# EAGLE design stmotor (EAGLE 7.2.0)
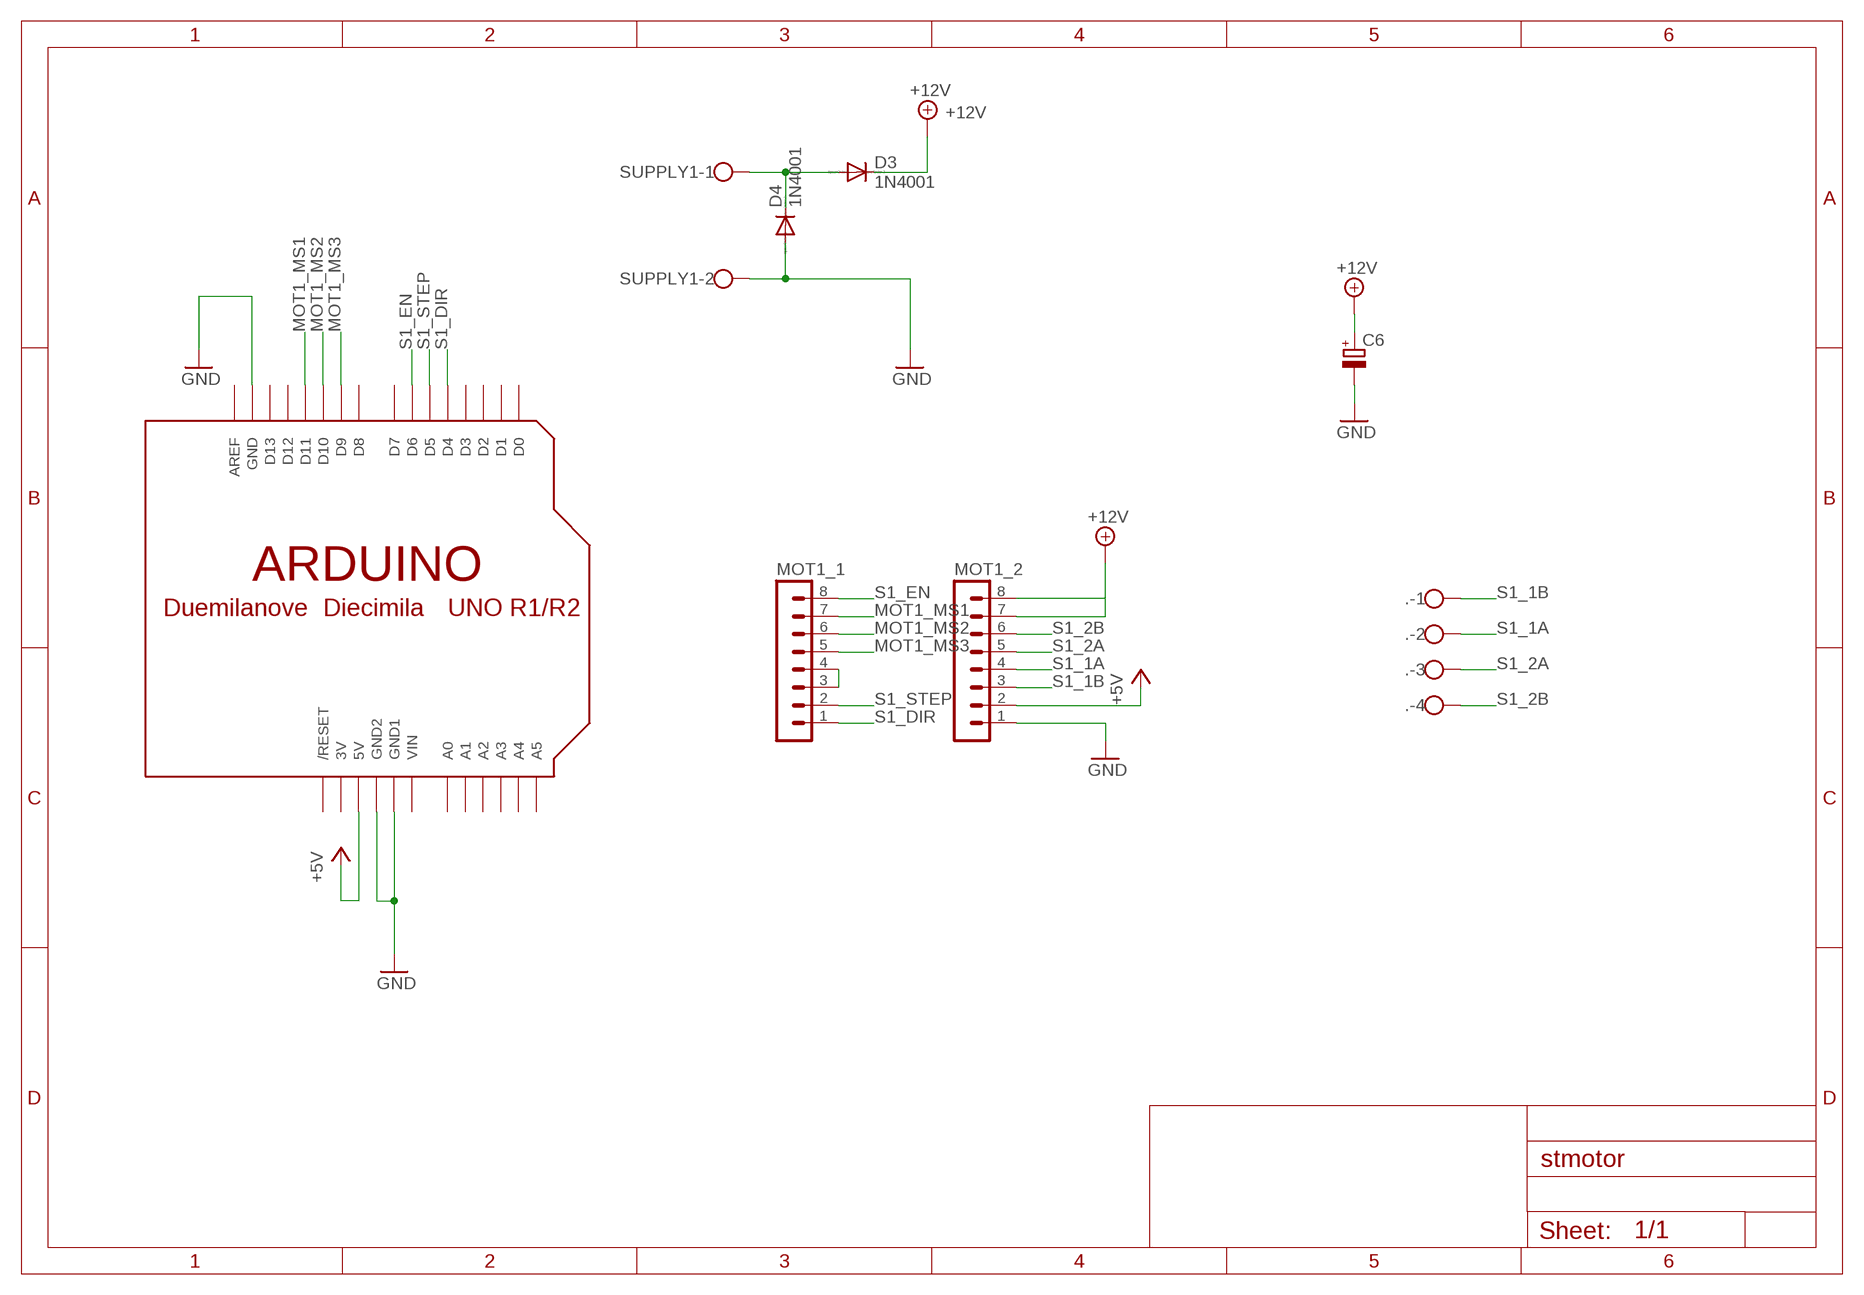
[diagram p0: schematic, sheet 1]

## Parts
.  W237-4  [W237-4]
C6  CPOL-EU153CLV-0807  [153CLV-0807]
D3  1N4001  1N4004  [DO41-10]
D4  1N4001  1N4004  [DO41-10]
MOT1_1  MA08-1  [MA08-1]
MOT1_2  MA08-1  [MA08-1]
SUPPLY1  W237-102  [W237-102]
U$1  ARDUINO-NOHOLE  [ARDUINO-NOHOLE]

## Nets
+5V: MOT1_2.2 U$1.5V
+12V: C6.+ D3.C MOT1_2.7
GND: C6.- D4.A MOT1_2.1 SUPPLY1.2 U$1.GND U$1.GND1 U$1.GND2
MOT1_MS1: MOT1_1.7 U$1.D11
MOT1_MS2: MOT1_1.6 U$1.D10
MOT1_MS3: MOT1_1.5 U$1.D9
N$1: D3.A D4.C SUPPLY1.1
N$2: MOT1_2.8
S1_1A: ..2 MOT1_2.4
S1_1B: ..1 MOT1_2.3
S1_2A: ..3 MOT1_2.5
S1_2B: ..4 MOT1_2.6
S1_DIR: MOT1_1.1 U$1.D4
S1_EN: MOT1_1.8 U$1.D6
S1_RST: MOT1_1.3 MOT1_1.4
S1_STEP: MOT1_1.2 U$1.D5
Unconnected: U$1.A0 U$1.A1 U$1.A2 U$1.A3 U$1.A4 U$1.A5 U$1.AREF U$1.D0 U$1.D1 U$1.D2 U$1.D3 U$1.D7 U$1.D8 U$1.D12 U$1.D13 U$1.RESET(/RESET)

## Power pins joined to a net without a drawn wire
3V: U$1.3V
VIN: U$1.VIN

## Library data of the parts
. = con-wago-500:W237-4: WAGO SCREW CLAMP; OC_FARNELL: unknown; OC_NEWARK: unknown
C6 = rcl:CPOL-EU: POLARIZED CAPACITOR, European symbol
D3 D4 = diode:1N4004: DIODE general purpose rectifier, 1 A
MOT1_1 MOT1_2 = con-lstb:MA08-1: PIN HEADER; OC_FARNELL: unknown; OC_NEWARK: unknown
SUPPLY1 = con-wago-500:W237-102: WAGO SCREW CLAMP; MPN: 237-102; OC_FARNELL: unknown; OC_NEWARK: 70K9898
U$1 = adafruit:ARDUINO: Arduino Diecimila/Duemilanove Make a shield with ease, this package has all the named pins as well as the two mounting drill holes and an outline of the USB and DC power connector. The outline is on the DIMENSION layer, so if your board house uses it they will cut the outline to match. http://www.ladyada.net/library/pcb/eaglelibrary.html

## Net classes
1 +12V: width 1.016 mm

## Board
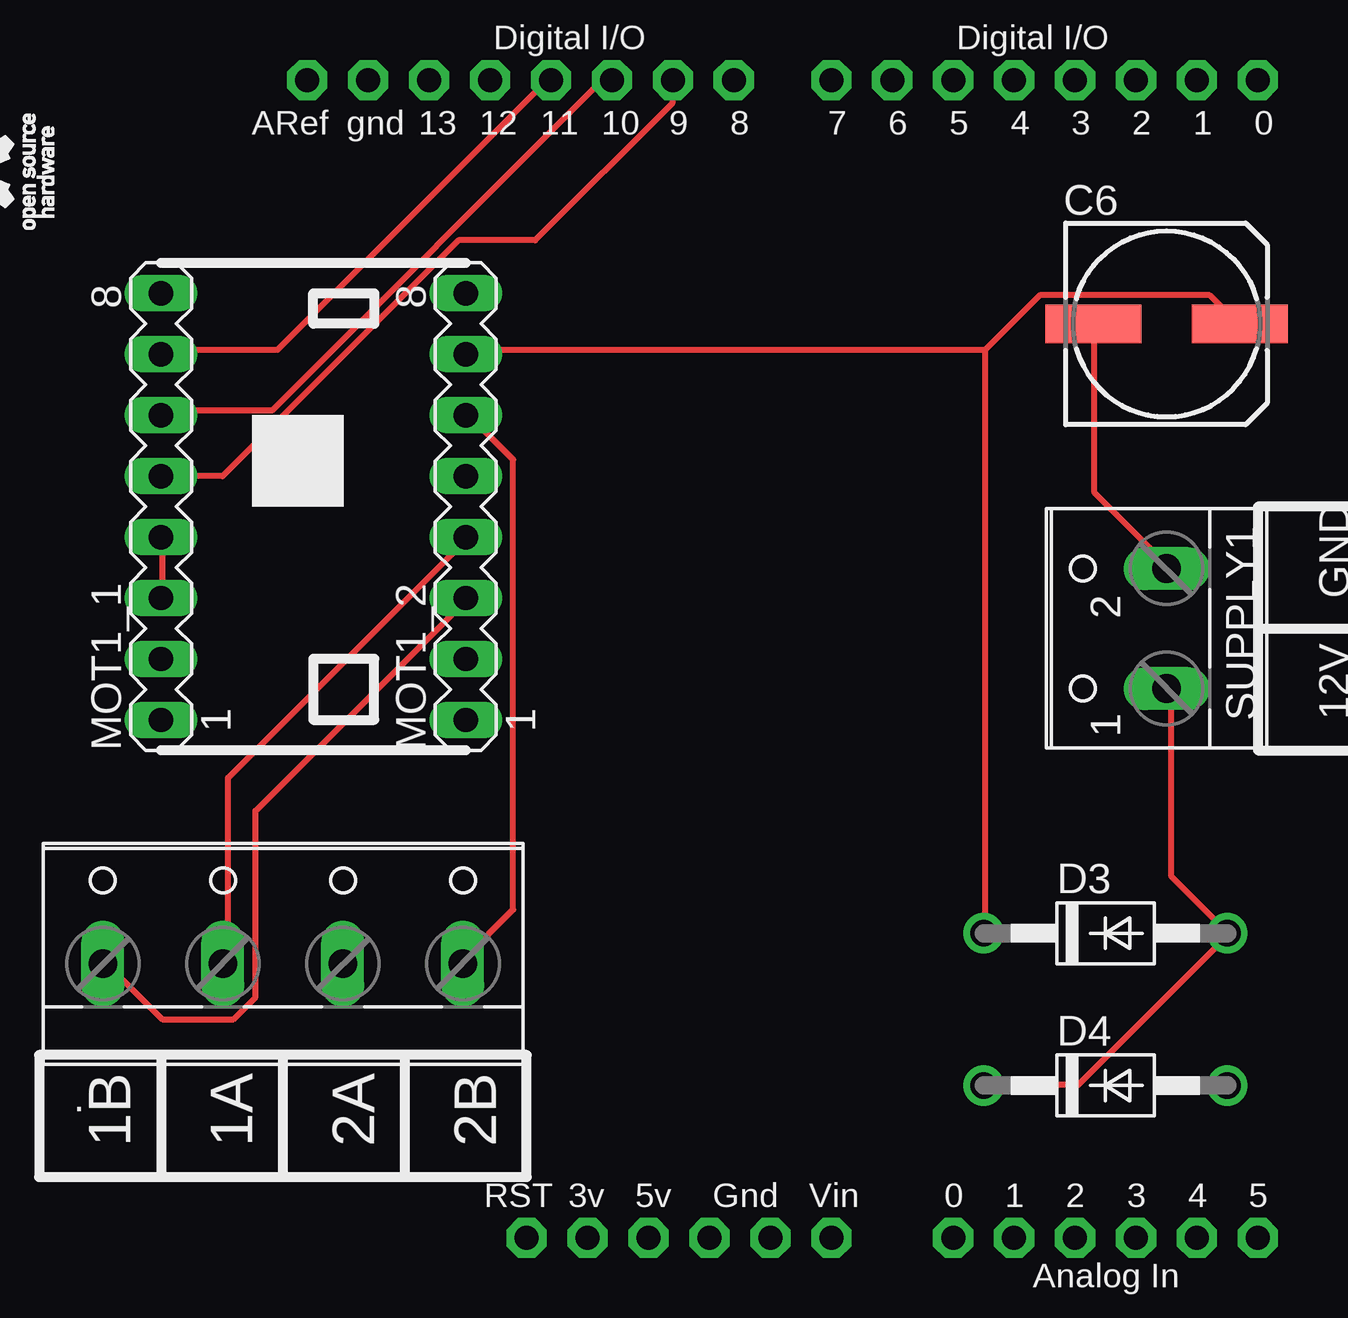
[diagram p1: board, top side]
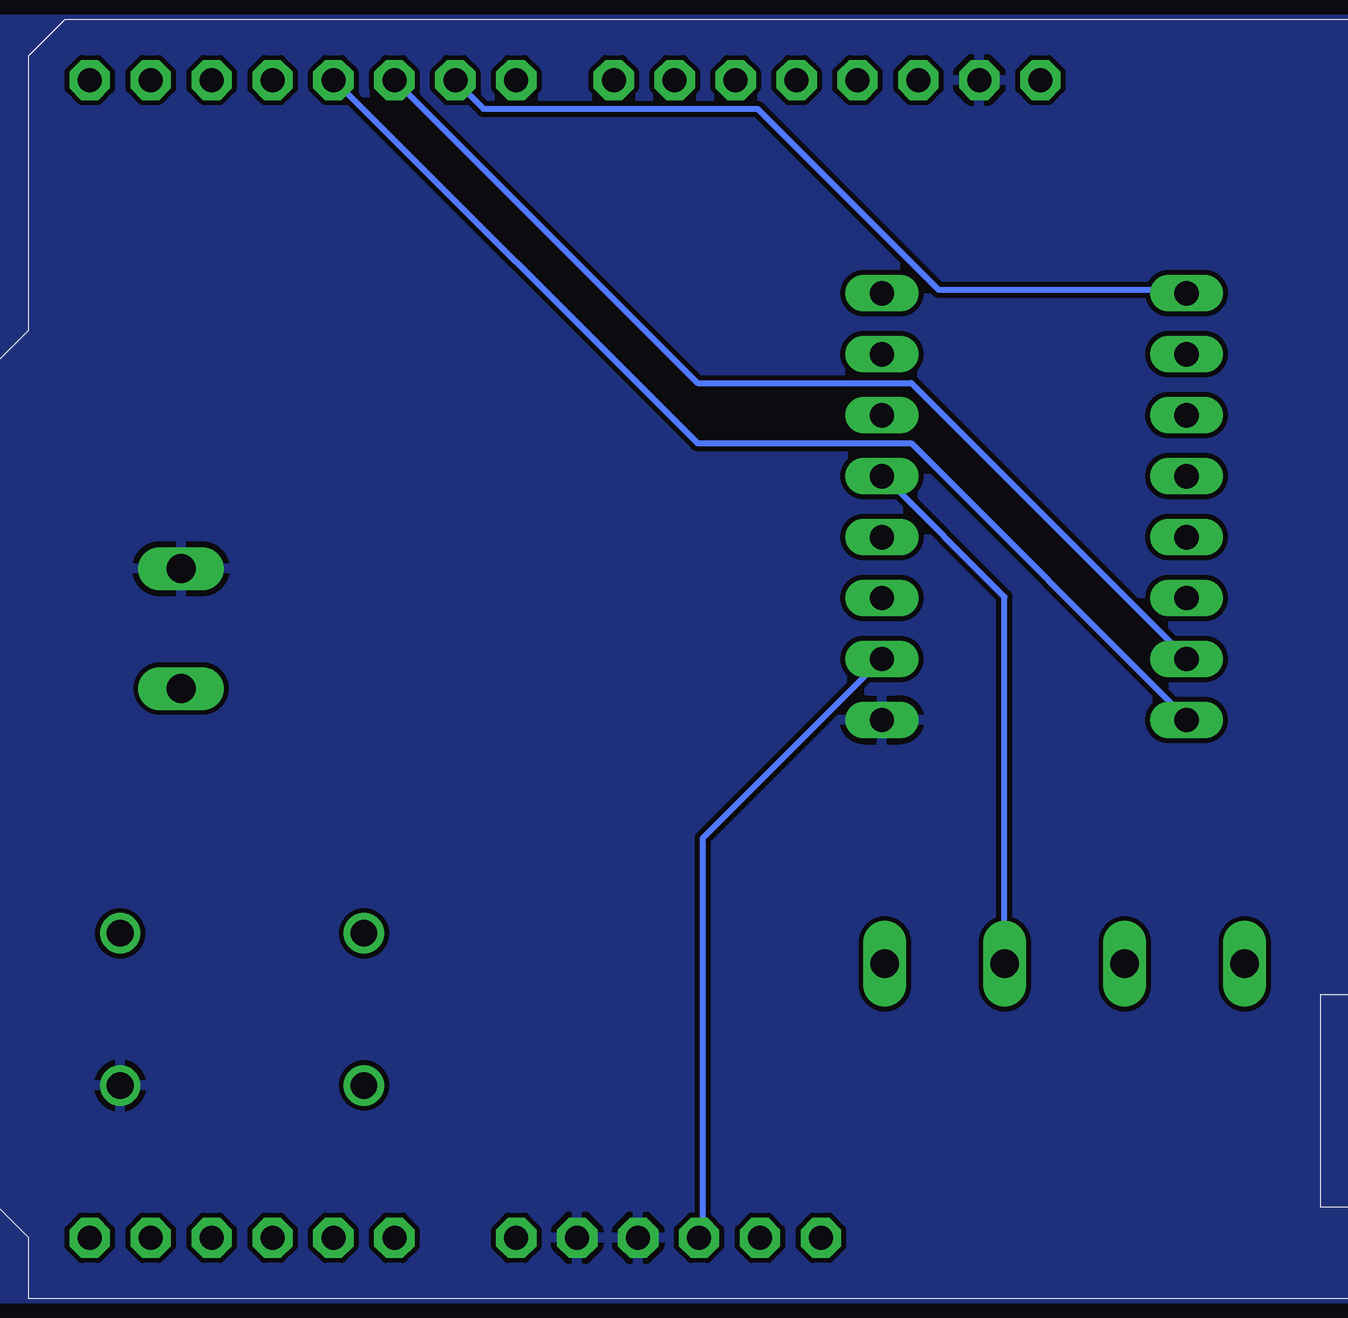
[diagram p2: board, bottom side, seen from below]

No outline drawn. Coordinates in mm, seen from the top.
Copper layers (1*16): Top 0.035mm / dielectric 1.5mm / Bottom 0.035mm
Design rules "default": minimum track width 10mil, minimum drill 24mil, track to track 8mil, track to pad 8mil, pad to pad 8mil, via to via 8mil, smd to smd 8mil, copper to edge 40mil, drill to drill 8mil, minimum pad ring 10mil, minimum via ring 8mil, stop-mask expansion 4mil, vias tented up to drill 0mil, thermal gap 10mil

### Footprints (pad centres in the part's own frame; a part is rotated, then mirrored left to right if it is on the bottom)
W237-4 = drill 1.194 long: 1 -7.5,-1.27; 2 -2.5,-1.27; 3 2.5,-1.27; 4 7.5,-1.27
153CLV-0807 = smd 4 x 1.6: + 3.05,0; - -3.05,0
DO41-10 = drill 1.118: A 5.08,0; C -5.08,0
MA08-1 = drill 1.016 long: 1 -8.89,0; 2 -6.35,0; 3 -3.81,0; 4 -1.27,0; 5 1.27,0; 6 3.81,0; 7 6.35,0; 8 8.89,0
W237-102 = drill 1.194 long: 1 -2.5,-1.27; 2 2.5,-1.27
ARDUINO-NOHOLE = drill 1 pad 1.676 octagon: 3V 35.56,2.54; 5V 38.1,2.54; A0 50.8,2.54; A1 53.34,2.54; A2 55.88,2.54; A3 58.42,2.54; A4 60.96,2.54; A5 63.5,2.54; AREF 23.876,50.8; D0 63.5,50.8; D1 60.96,50.8; D2 58.42,50.8; D3 55.88,50.8; D4 53.34,50.8; D5 50.8,50.8; D6 48.26,50.8; D7 45.72,50.8; D8 41.656,50.8; D9 39.116,50.8; D10 36.576,50.8; D11 34.036,50.8; D12 31.496,50.8; D13 28.956,50.8; GND 26.416,50.8; GND1 43.18,2.54; GND2 40.64,2.54; RESET 33.02,2.54; VIN 45.72,2.54

### Placement (x,y rotation side)
.  22.86,15.24 0 top
C6  59.69,40.64 0 top
D3  57.15,15.24 0 top
D4  57.15,8.89 0 top
MOT1_1  17.78,33.02 90 top
MOT1_2  30.48,33.02 90 top
SUPPLY1  58.42,27.94 90 top
U$1  0,0 0 top
U$2  [LOGO_FABO_M]  5.08,46.99 90 top
U$3  [LOGO_OSHW_T_M]  10.16,46.99 90 top

### Tracks (layer width: path | path; a pad name or v marks a point on that pad's centre or on a via)
+5V
  Bottom 0.254: MOT1_2.2 37.95,19.2 37.95,2.74 U$1.5V
+12V
  Top 0.254: 52.12,39.55 30.63,39.55 MOT1_2.7 | 52.12,39.55 54.41,41.83 61.49,41.83 62.64,40.69 C6.+ | 52.12,39.55 52.12,15.32 D3.C
GND
  Top 0.254: C6.- 56.69,40.46 56.69,33.6 59.66,30.63 SUPPLY1.2
  pour Bottom: 0,0 68.58,0 68.58,53.34 0,53.34
MOT1_MS1
  Top 0.254: MOT1_1.7 17.83,39.55 22.63,39.55 33.83,50.75 U$1.D11
MOT1_MS2
  Top 0.254: MOT1_1.6 17.83,37.03 22.4,37.03 36.12,50.75 36.58,50.75 U$1.D10
MOT1_MS3
  Top 0.254: MOT1_1.5 20.34,34.29 30.18,44.12 33.38,44.12 39.09,49.84 39.09,50.75 U$1.D9
N$1
  Top 0.254: D4.C 52.12,8.91 56.01,8.91 62.18,15.09 D3.A 62.18,15.32 59.89,17.6 59.89,25.38 SUPPLY1.1
S1_1A
  Top 0.254: MOT1_2.4 30.4,31.55 20.57,21.72 20.57,14.17 ..2
S1_1B
  Top 0.254: MOT1_2.3 30.4,29.03 21.72,20.34 21.72,12.57 20.8,11.66 17.83,11.66 15.54,13.95 ..1
S1_2A
  Bottom 0.254: MOT1_2.5 30.4,34.29 25.38,29.26 25.38,14.17 ..3
S1_2B
  Top 0.254: MOT1_2.6 30.63,36.8 32.46,34.98 32.46,16.23 30.4,14.17 ..4
S1_DIR
  Bottom 0.254: MOT1_1.1 17.83,24.23 29.26,35.66 38.18,35.66 53.26,50.75 U$1.D4
S1_EN
  Bottom 0.254: MOT1_1.8 17.83,42.06 28.12,42.06 35.66,49.61 47.09,49.61 48.23,50.75 U$1.D6
S1_RST
  Top 0.254: MOT1_1.3 17.83,29.26 17.83,31.55 MOT1_1.4
S1_STEP
  Bottom 0.254: U$1.D5 38.18,38.18 29.26,38.18 17.83,26.75 MOT1_1.2

### Text on the board
tPlace: Stepping Motor / Rev.Beta | GND | 12V | 1B | 1A | 2A | 2B